# EAGLE design TrackerBreakout (EAGLE 6.2)
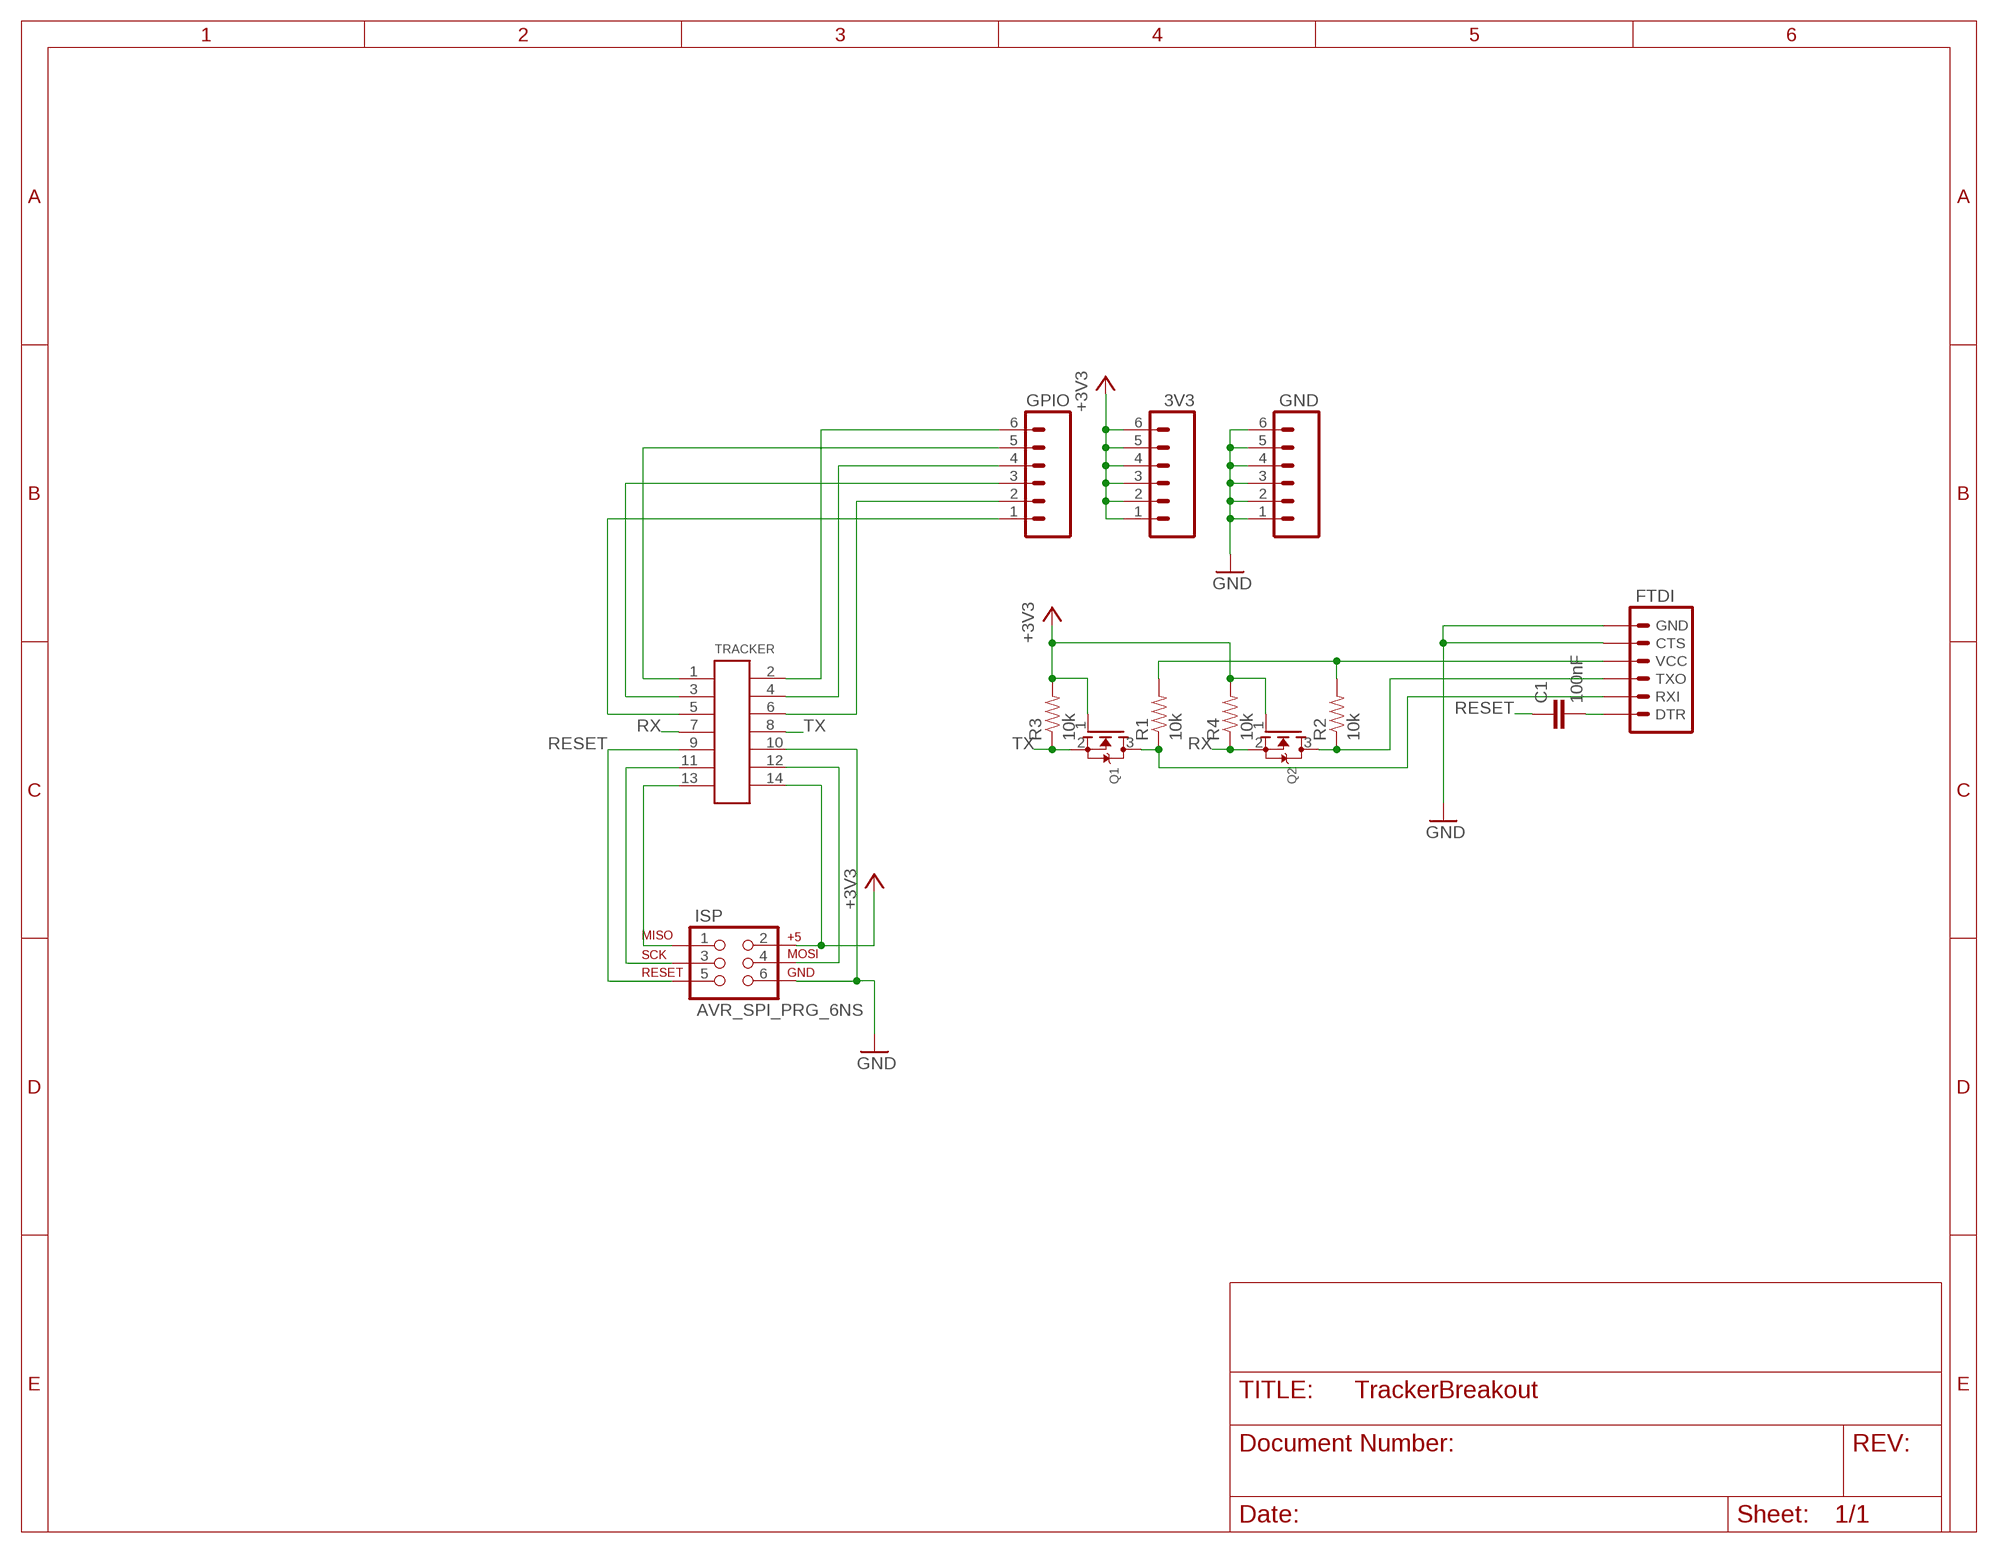
[diagram p0: schematic, sheet 1]

## Parts
3V3  M06SIP  [1X06]
C1  100nF  CAP0402-CAP  [0402-CAP]
FTDI  ARDUINO_SERIAL_PROGRAMPTH  [1X06]
GND  M06SIP  [1X06]
GPIO  M06SIP  [1X06]
ISP  AVR_SPI_PRG_6NS  [2X3-NS]
Q1  MOSFET-N  [SOT416]
Q2  MOSFET-N  [SOT416]
R1  10k  RESISTOR0402-RES  [0402-RES]
R2  10k  RESISTOR0402-RES  [0402-RES]
R3  10k  RESISTOR0402-RES  [0402-RES]
R4  10k  RESISTOR0402-RES  [0402-RES]
TRACKER  DF12A3.0-14DS  [DF12A3.0-14DS]

## Nets
+3V3: 3V3.1 3V3.2 3V3.3 3V3.4 3V3.5 3V3.6 ISP.2 Q1.1(G) Q2.1(G) R3.2 R4.2 TRACKER.14
GND: FTDI.5(CTS) FTDI.6(GND) GND.1 GND.2 GND.3 GND.4 GND.5 GND.6 ISP.6 TRACKER.10
N$1: GPIO.1 TRACKER.5
N$2: GPIO.2 TRACKER.6
N$3: GPIO.3 TRACKER.3
N$4: GPIO.4 TRACKER.4
N$5: GPIO.5 TRACKER.1
N$6: GPIO.6 TRACKER.2
N$7: ISP.3 TRACKER.11
N$9: ISP.4 TRACKER.12
N$10: FTDI.4(VCC) R1.2 R2.2
N$11: ISP.1 TRACKER.13
N$12: C1.2 FTDI.1(DTR)
N$13: FTDI.3(TXO) Q2.3(D) R2.1
N$15: FTDI.2(RXI) Q1.3(D) R1.1
RESET: C1.1 ISP.5 TRACKER.9
RX: Q2.2(S) R4.1 TRACKER.7
TX: Q1.2(S) R3.1 TRACKER.8

## Library data of the parts
3V3 GND GPIO = SparkFun-Connectors:M06: Header 6 Standard 6-pin 0.1" header. Use with straight break away headers (SKU : PRT-00116), right angle break away headers (PRT-00553), swiss pins (PRT-00743), machine pins (PRT-00117), and female headers (PRT-00115). Molex polarized connector foot print use with SKU : PRT-08094 with associated crimp pins and housings. NOTES ON THE VARIANTS LOCK and LOCK_LONGPADS... This footprint was designed to help hold the alignment of a through-hole component (i.e. 6-pin header) while soldering it into place. You may notice that each hole has been shifted either up or down by 0.005 of an inch from it's more standard position (which is a perfectly straight line). This slight alteration caused the pins (the squares in the middle) to touch the edges of the holes. Because they are alternating, it causes a "brace" to hold the component in place. 0.005 has proven to be the perfect amount of "off-center" position when using our standard breakaway headers. Although looks a little odd when you look at the bare footprint, once you have a header in there, the alteration is very hard to notice. Also, if you push a header all the way into place, it is covered up entirely on the bottom side. This idea of altering the position of holes to aid alignment will be further integrated into the Sparkfun Library for other footprints. It can help hold any component with 3 or more connection pins.
C1 = SparkFun-Passives:CAP: Capacitor Standard 0603 ceramic capacitor, and 0.1" leaded capacitor.
FTDI = SparkFun-Connectors:ARDUINO_SERIAL_PROGRAM: FTDI connector footprints
ISP = SparkFun-Connectors:AVR_SPI_PRG_6: AVR ISP 6 Pin This is the reduced ISP connector for AVR programming. Common on Arduino. This footprint will take up less PCB space and can be used with a 10-pin to 6-pin adapter such as SKU: BOB-08508
Q1 Q2 = adjacent-reality:MOSFET-N: N-Channel Mosfet 2N7002E - 60V 260mA SOT23 [Digikey: 2N7002ET1GOSTR-ND] - REEL BSH103 - 30V 850mA SOT23 [Digikey: 568-5013-1-ND]
R1-R4 = SparkFun-Passives:RESISTOR: Resistor Basic schematic elements and footprints for 0603, 1206, and PTH resistors.
TRACKER = adjacent-reality:DF12A3.0-14DS

## Board
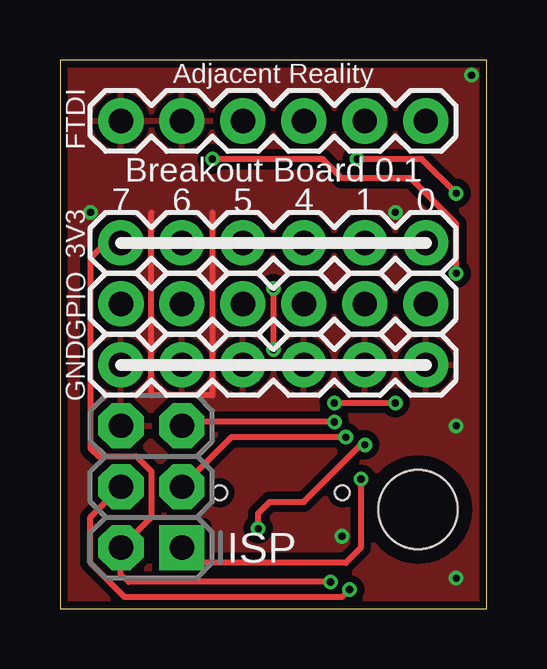
[diagram p1: board, top side]
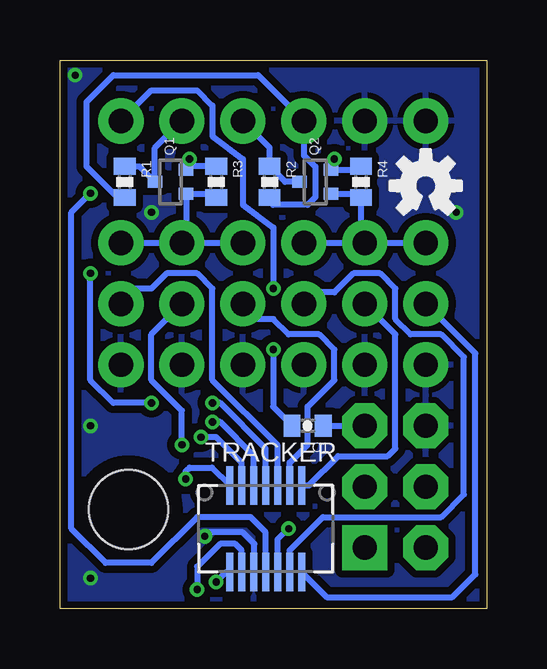
[diagram p2: board, bottom side, seen from below]

Size 17.78 x 22.86 mm. Coordinates in mm from the lower left corner, seen from the top.
Outline: 0,0 17.78,0 17.78,22.86 0,22.86 0,0
Copper layers (1*16): Top 0.035mm / dielectric 1.5mm / Bottom 0.035mm
Design rules: minimum track width 6mil, minimum drill 12mil, track to track 6mil, track to pad 6mil, pad to pad 6mil, via to via 6mil, smd to smd 0mil, copper to edge 10mil, drill to drill 10mil, minimum pad ring 10mil, minimum via ring 6mil, stop-mask expansion 2mil, vias tented up to drill 100mil, thermal gap 10mil

### Footprints (pad centres in the part's own frame; a part is rotated, then mirrored left to right if it is on the bottom)
1X06 = drill 1.016 pad 1.88: 1 0,0; 2 2.54,0; 3 5.08,0; 4 7.62,0; 5 10.16,0; 6 12.7,0
0402-CAP = smd 0.7 x 0.9: 1 -0.65,0; 2 0.65,0
2X3-NS = drill 1.016 pad 1.88 square: 1 -2.54,-1.27 | drill 1.016 pad 1.88 octagon: 2 -2.54,1.27; 3 0,-1.27; 4 0,1.27; 5 2.54,-1.27; 6 2.54,1.27
SOT416 = smd 0.5 x 0.6: 1 -0.5,-0.65; 2 0.5,-0.65; 3 0,0.65
0402-RES = smd 0.7 x 0.9: 1 -0.65,0; 2 0.65,0
DF12A3.0-14DS = smd 0.3 x 1.6: 1 1.5,1.8; 2 1.5,-1.8; 3 1,1.8; 4 1,-1.8; 5 0.5,1.8; 6 0.5,-1.8; 7 0,1.8; 8 0,-1.8; 9 -0.5,1.8; 10 -0.5,-1.8; 11 -1,1.8; 12 -1,-1.8; 13 -1.5,1.8; 14 -1.5,-1.8 | hole 0.6: -2.55,1.5; 2.55,1.5
STAND-OFF = hole 3.302: 0,0

### Placement (x,y rotation side)
3V3  15.24,15.24 180 top
C1  7.46,7.62 180 bottom
FTDI  15.24,20.32 180 top
GND  15.24,10.16 180 top
GPIO  15.24,12.7 180 top
ISP  3.81,5.08 90 top
Q1  13.18,17.78 90 bottom
Q2  7.14,17.78 90 bottom
R1  15.08,17.78 270 bottom
R2  9.05,17.78 270 bottom
R3  11.27,17.78 270 bottom
R4  5.24,17.78 270 bottom
TRACKER  9.21,3.33 0 bottom
U$1  [STAND-OFF]  14.92,4.13 0 top
U$2  [OSHW-LOGO-S]  2.54,17.62 0 bottom

### Tracks (layer width: path | path; a pad name or v marks a point on that pad's centre or on a via)
+3V3  (via drill 0.3)
  Top 0.254: 3V3.4 3V3.3 | v11.27,1.11 2.86,1.11 2.54,1.43 ISP.2 3.81,3.81 3.81,5.71 3.17,6.35 1.59,6.35 1.27,6.67 1.27,14.61 1.91,15.24 3V3.6
  Bottom 0.254: Q2.1 5.39,17.28 R4.2 5.24,15.4 3V3.5 | R3.2 11.42,17.28 Q1.1 12.53,15.41 3V3.2 | TRACKER.14 10.85,1.53 v11.27,1.11 | 3V3.1 3V3.2 | 3V3.2 3V3.3 | 3V3.4 3V3.5 | 3V3.5 3V3.6
GND  (via drill 0.3)
  Top 0.254: 6.35,16.51 6.35,8.89 3.81,8.89 3.81,16.51
  Bottom 0.254: 11.59,3.17 10.16,3.17 9.68,2.7 9.68,2.06 9.71,2.04 TRACKER.10
  other vias: 1.27,16.51 13.97,16.51 16.51,1.27 16.51,7.62 17.14,22.23 11.75,3.02
  pour Top (isolate 0.305): 0,22.86 0,0 17.78,0 17.78,22.86
  pour Bottom (isolate 0.305): 0,22.86 0,0 17.78,0 17.78,22.86
N$1
  Bottom 0.254: TRACKER.5 8.71,6.8 11.43,9.53 11.43,13.34 12.06,13.97 13.34,13.97 13.97,13.34 14.61,13.34 GPIO.1
N$2  (via drill 0.3)
  Top 0.254: v8.26,3.33 8.26,3.97 8.73,4.45 10.16,4.45 12.54,6.83 v12.7,6.83
  Bottom 0.254: GPIO.2 13.97,11.43 13.97,9.53 12.7,8.26 v12.7,6.83 | TRACKER.6 8.71,2.88 v8.26,3.33
N$3
  Bottom 0.254: TRACKER.3 8.21,6.08 7.46,6.83 7.46,8.41 6.35,9.53 6.35,10.79 6.99,11.43 8.26,11.43 8.89,12.06 9.53,12.06 GPIO.3
N$4
  Bottom 0.254: TRACKER.4 8.21,2.43 6.83,3.81 1.91,3.81 0.95,4.76 0.95,10.48 1.91,11.43 3.17,11.43 3.81,12.06 3.81,13.34 4.45,13.97 5.56,13.97 6.35,13.18 7.14,13.18 GPIO.4
N$5
  Bottom 0.254: TRACKER.1 7.41,5.13 6.19,6.35 4.13,6.35 3.81,6.67 3.81,11.43 GPIO.5
N$6
  Bottom 0.254: TRACKER.2 7.71,1.52 6.67,0.48 1.43,0.48 0.48,1.43 0.48,10.64 GPIO.6
N$7  (via drill 0.3)
  Top 0.254: v11.91,7.14 7.14,7.14 ISP.3
  Bottom 0.254: TRACKER.11 10.21,6.08 11.27,7.14 v11.91,7.14
N$9  (via drill 0.3)
  Top 0.254: v12.06,0.79 11.75,0.48 2.7,0.48 1.27,1.91 1.27,3.81 ISP.4
  Bottom 0.254: TRACKER.12 10.21,2.43 10.48,2.7 11.11,2.7 12.06,1.75 v12.06,0.79
N$10
  Bottom 0.254: R2.2 8.9,16.83 7.46,16.83 7.14,17.14 7.14,18.41 7.62,18.89 FTDI.4 9.53,22.23 15.56,22.23 16.67,21.11 16.67,18.41 15.38,17.13 R1.2
N$11  (via drill 0.3)
  Top 0.254: v12.54,5.4 12.54,2.54 11.91,1.91 5.71,1.91 ISP.1
  Bottom 0.254: v12.54,5.4 12.54,5.71 12.38,5.87 11.45,5.87 TRACKER.13
N$12  (via drill 0.3)
  Top 0.254: v8.89,13.34 v8.89,10.79
  Bottom 0.254: FTDI.1 13.97,21.59 12.06,21.59 11.43,20.95 11.43,19.68 10.16,18.73 10.16,16.83 8.89,15.88 v8.89,13.34 | v8.89,10.79 8.9,8.41 C1.2
N$13
  Bottom 0.254: Q2.3 8.4,17.78 R2.1 9.05,19.21 FTDI.3
N$15
  Bottom 0.254: FTDI.2 13.83,19.19 Q1.3 14.48,18.43 R1.1
RESET  (via drill 0.3)
  Top 0.254: v11.43,7.78 5.24,7.78 ISP.5
  Bottom 0.254: C1.1 ISP.5 | TRACKER.9 9.71,6.37 11.11,7.78 v11.43,7.78
RX  (via drill 0.3)
  Top 0.254: v6.35,18.73 10.95,18.73 11.75,17.94 14.61,17.94 16.51,16.03 v16.51,13.97 | v11.43,8.57 v13.97,8.57
  Bottom 0.254: R4.1 5.39,18.28 Q2.2 6.49,18.59 v6.35,18.73 | TRACKER.7 9.21,6.67 11.11,8.57 v11.43,8.57 | v13.97,8.57 15.56,8.57 16.51,9.53 v16.51,13.97
TX  (via drill 0.3)
  Top 0.254: v16.51,17.3 15.08,18.73 v12.38,18.73
  Bottom 0.254: R3.1 12.38,18.43 Q1.2 12.53,18.59 v12.38,18.73 | TRACKER.8 9.21,3.17 9.84,3.81 12.06,3.81 13.97,1.91 15.88,1.91 17.3,3.33 17.3,16.51 v16.51,17.3

### Text on the board
tPlace: Adjacent Reality | Breakout Board 0.1 | 7 | 6 | 5 | 4 | 1 | 0